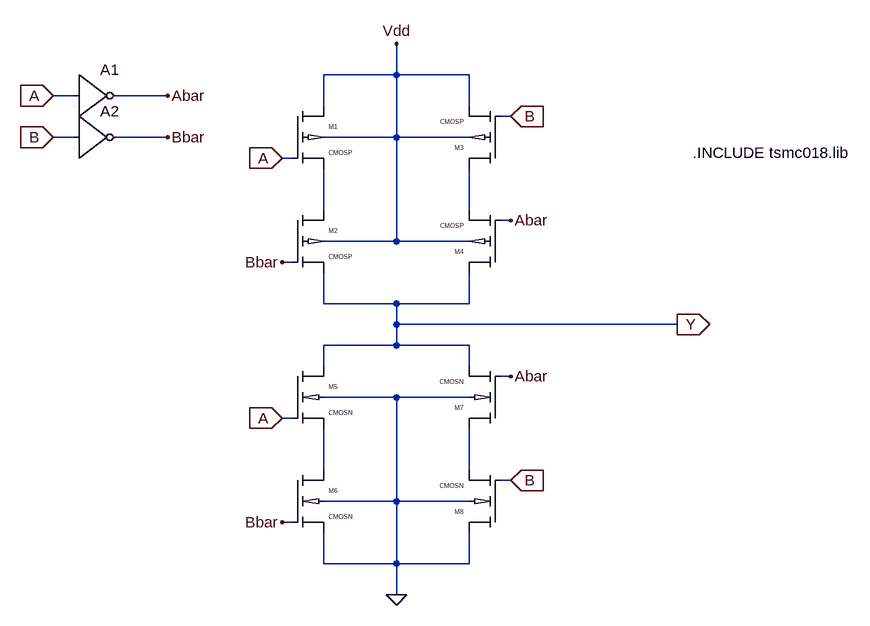
[diagram p0: schematic XOR3.asc]
XOR3.asc, the LTspice schematic file:
Version 4
SHEET 1 880 772
WIRE -160 -48 -160 -96
WIRE -160 -48 -272 -48
WIRE -48 -48 -160 -48
WIRE -656 -16 -688 -16
WIRE -512 -16 -592 -16
WIRE -272 0 -272 -48
WIRE -48 0 -48 -48
WIRE 16 16 0 16
WIRE -656 48 -688 48
WIRE -512 48 -592 48
WIRE -160 48 -160 -48
WIRE -160 48 -272 48
WIRE -48 48 -160 48
WIRE -320 80 -336 80
WIRE -272 160 -272 96
WIRE -48 160 -48 96
WIRE 16 176 0 176
WIRE -160 208 -160 48
WIRE -160 208 -272 208
WIRE -48 208 -160 208
WIRE -320 240 -336 240
WIRE -272 304 -272 256
WIRE -160 304 -272 304
WIRE -48 304 -48 256
WIRE -48 304 -160 304
WIRE -160 336 -160 304
WIRE 272 336 -160 336
WIRE -160 368 -160 336
WIRE -160 368 -272 368
WIRE -48 368 -160 368
WIRE -272 400 -272 368
WIRE -48 400 -48 368
WIRE 16 416 0 416
WIRE -160 448 -272 448
WIRE -48 448 -160 448
WIRE -320 480 -336 480
WIRE -272 560 -272 496
WIRE -48 560 -48 496
WIRE 16 576 0 576
WIRE -160 608 -160 448
WIRE -160 608 -272 608
WIRE -48 608 -160 608
WIRE -320 640 -336 640
WIRE -272 704 -272 656
WIRE -160 704 -160 608
WIRE -160 704 -272 704
WIRE -48 704 -48 656
WIRE -48 704 -160 704
WIRE -160 752 -160 704
FLAG -160 -96 Vdd
FLAG -160 752 0
FLAG -688 -16 A
IOPIN -688 -16 In
FLAG -336 80 A
IOPIN -336 80 In
FLAG -336 480 A
IOPIN -336 480 In
FLAG -688 48 B
IOPIN -688 48 In
FLAG 16 16 B
IOPIN 16 16 In
FLAG 16 576 B
IOPIN 16 576 In
FLAG -512 -16 Abar
FLAG 16 176 Abar
FLAG 16 416 Abar
FLAG -336 640 Bbar
FLAG -336 240 Bbar
FLAG -512 48 Bbar
FLAG 272 336 Y
IOPIN 272 336 Out
SYMBOL Pcmos -320 0 R0
SYMATTR InstName M1
SYMBOL Pcmos -320 160 R0
SYMATTR InstName M2
SYMBOL Pcmos 0 96 R180
SYMATTR InstName M3
SYMBOL Pcmos 0 256 R180
SYMATTR InstName M4
SYMBOL Ncmos -320 400 R0
SYMATTR InstName M5
SYMBOL Ncmos -320 560 R0
SYMATTR InstName M6
SYMBOL Ncmos 0 496 R180
SYMATTR InstName M7
SYMBOL Ncmos 0 656 R180
SYMATTR InstName M8
SYMBOL Digital\\inv -656 -80 R0
SYMATTR InstName A1
SYMBOL Digital\\inv -656 -16 R0
SYMATTR InstName A2
TEXT 296 72 Left 2 !.INCLUDE tsmc018.lib

The netlist it stands for:
* XOR3.asc
M1 Vdd A N001 Vdd CMOSP
M2 N001 Bbar Y Vdd CMOSP
M3 N002 B Vdd Vdd CMOSP
M4 Y Abar N002 Vdd CMOSP
M5 Y A N003 0 CMOSN
M6 N003 Bbar 0 0 CMOSN
M7 N004 Abar Y 0 CMOSN
M8 0 B N004 0 CMOSN
A1 A 0 0 0 0 Abar 0 0 BUF
A2 B 0 0 0 0 Bbar 0 0 BUF
.model NMOS NMOS
.model PMOS PMOS
.lib standard.mos
.INCLUDE tsmc018.lib
.lib tsmc018.lib
.backanno
.end